# Altium schematic sheet DE-160724.SchDoc: Toroid soft start
size A3; Author: eldar6776@hotmail.com; DrawnBy: Eldar Dedic; Organization: JUBERA d.o.o.; Address1: Braće Mulić 81; Address2: 71000 Sarajevo; Address3: Federacija BiH; Address4: Bosna i Hercegovina; DocumentNumber: DE-100224; Revision: 278; SheetNumber: 1; SheetTotal: 2
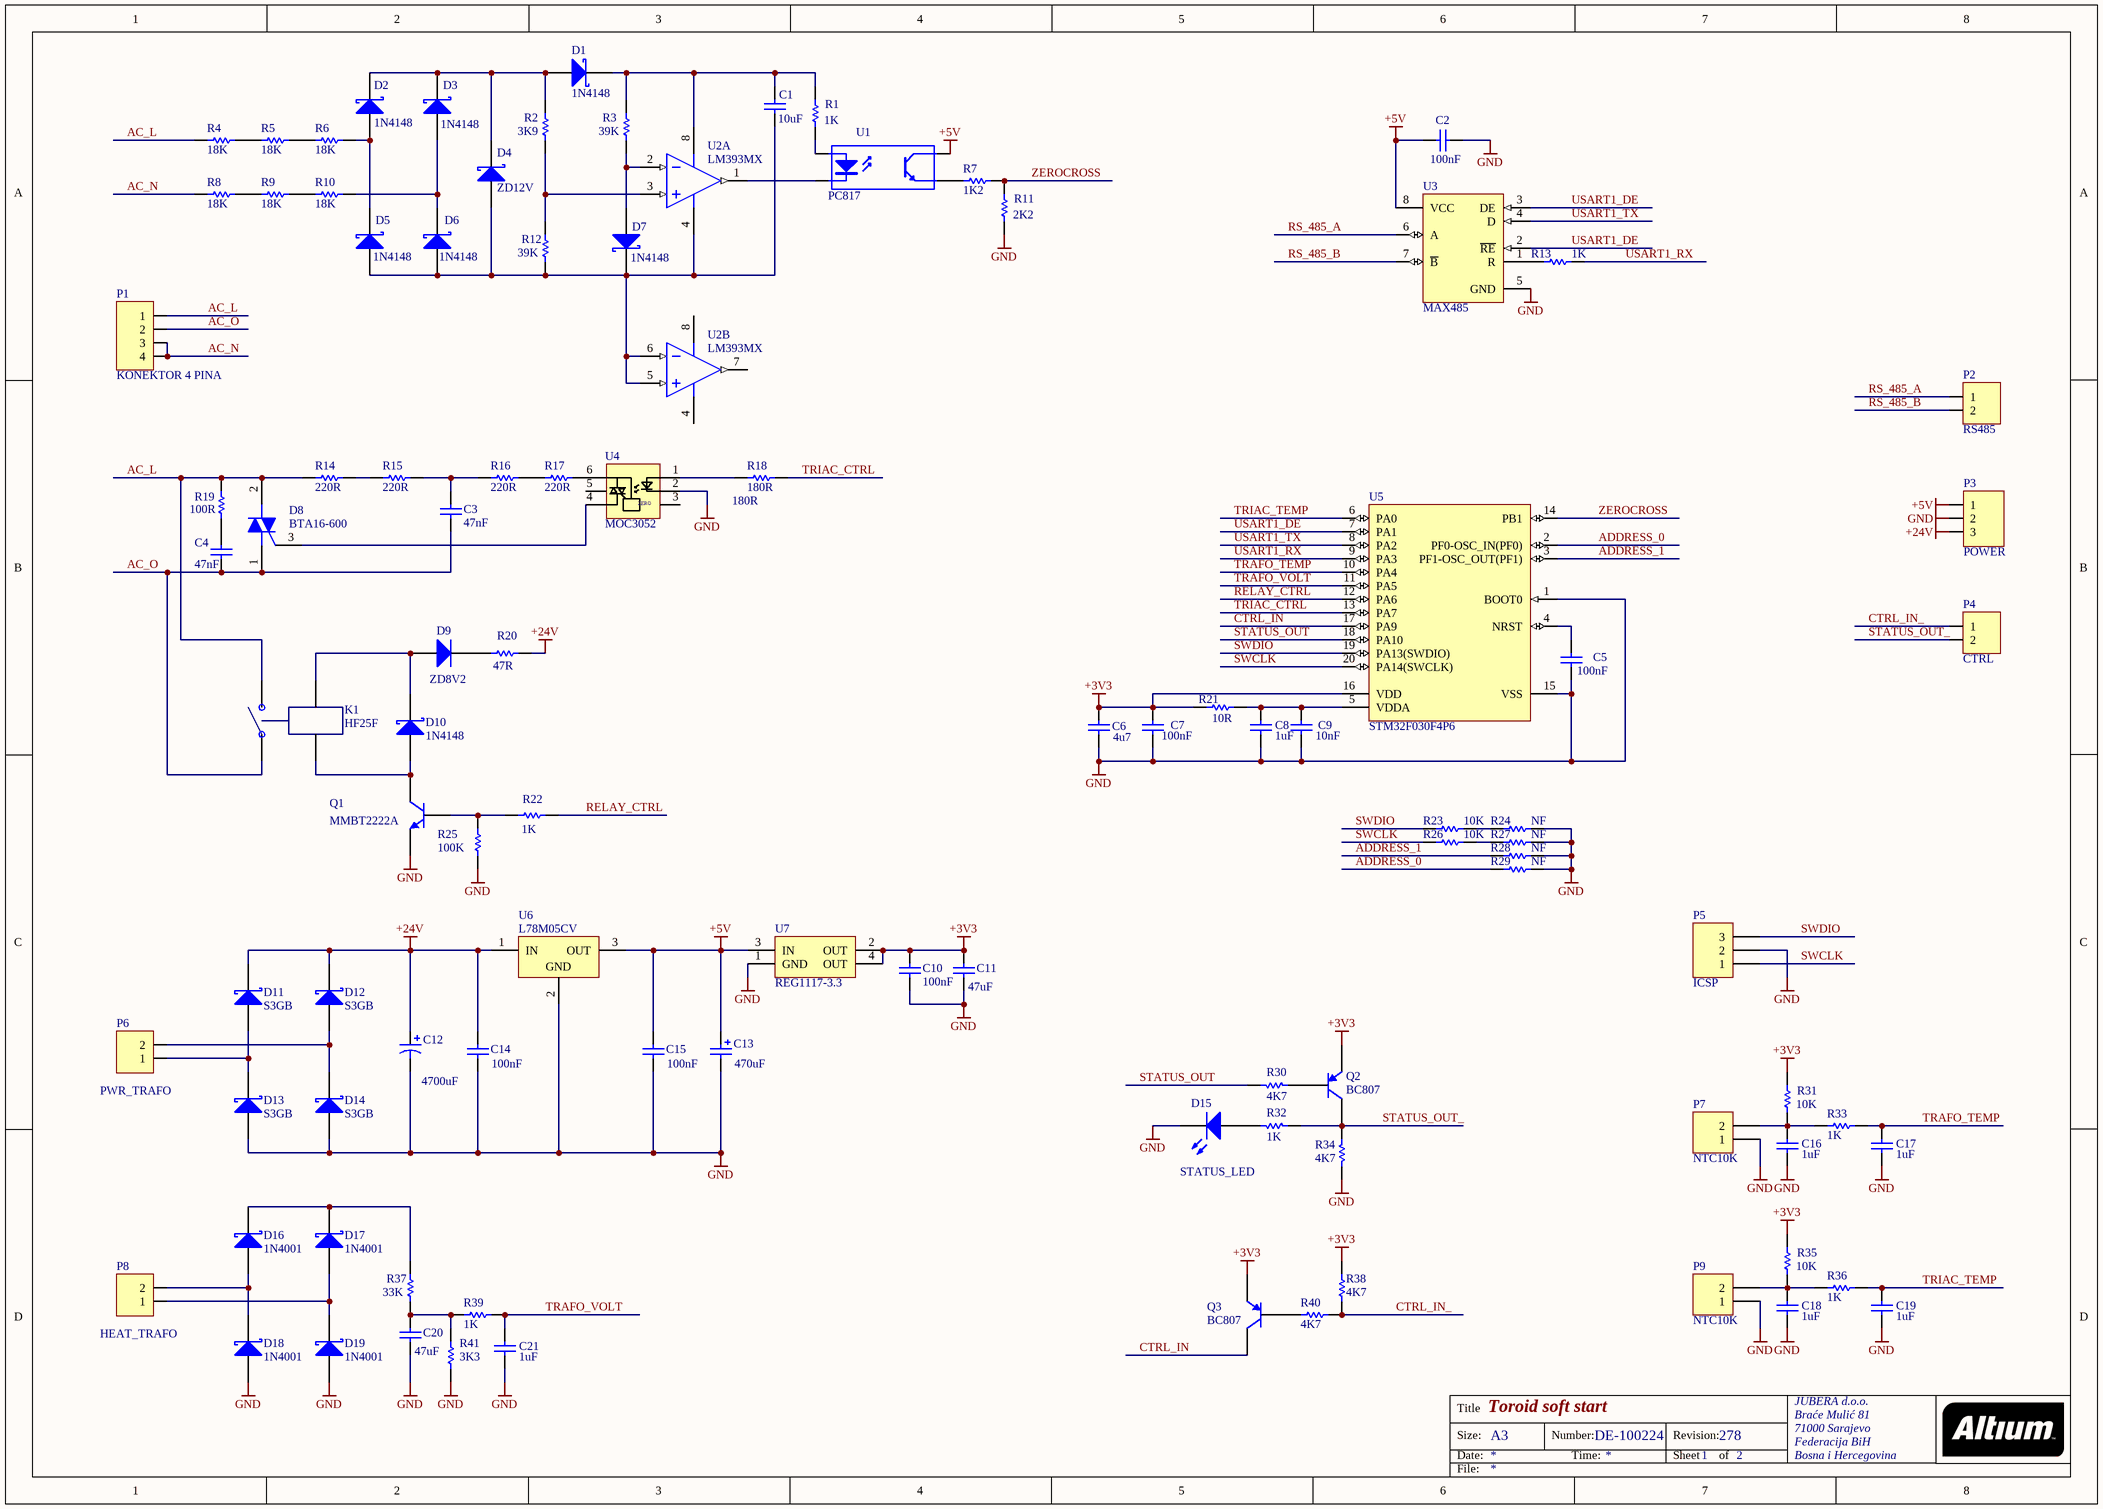
[diagram p0: DE-160724.SchDoc]

## Parts
C1  10uF  [0805]
C2  100nF  [0603]
C3  47nF  [X2 CAP]
C4  47nF  [X2 CAP]
C5  100nF  [0603]
C6  4u7  [0805]
C7  100nF  [0603]
C8  1uF  [0603]
C9  10nF  [0603]
C10  100nF  [0603]
C11  value 47uF  [1206]  (hidden comment: C1206)
C12  4700uF  [CAPPR5-13X25]
C13  470uF  [CAPPR5-10X16]
C14  100nF  [0603]
C15  100nF  [0603]
C16  1uF  [0603]
C17  1uF  [0603]
C18  1uF  [0603]
C19  1uF  [0603]
C20  value 47uF  [1206]  (hidden comment: C1206)
C21  1uF  [0603]
D1  1N4148  [SOD323]
D2  1N4148  [SOD323]
D3  1N4148  [SOD323]
D4  ZD12V  [SMB]
D5  1N4148  [SOD323]
D6  1N4148  [SOD323]
D7  1N4148  [SOD323]
D8  BTA16-600  [ONSC-TO-220-3-221A-07]
D9  ZD8V2  [DO-41]
D10  1N4148  [SOD323]
D11  S3GB  [SMB]
D12  S3GB  [SMB]
D13  S3GB  [SMB]
D14  S3GB  [SMB]
D15  STATUS_LED  [1.6X0.8X0.8]
D16  1N4001  [SMB]
D17  1N4001  [SMB]
D18  1N4001  [SMB]
D19  1N4001  [SMB]
K1  HF25F  [HF25F]
P1  KONEKTOR 4 PINA  [KONEKTOR 4 PINA]
P2  RS485  [TERMINAL BLOK 2]
P3  POWER  [TERMINAL BLOK 3]
P4  CTRL  [TERMINAL BLOK 2]
P5  ICSP  [HDR1X3]
P6  PWR_TRAFO  [KONEKTOR 2 PINA]
P7  NTC10K  [HDR1X2]
P8  HEAT_TRAFO  [KONEKTOR 2 PINA]
P9  NTC10K  [HDR1X2]
Q1  MMBT2222A  [SOT23_N]
Q2  BC807  [SOT23_N]
Q3  BC807  [SOT23_N]
R1  1K  [ERA-0603]
R2  3K9  [ERA-0603]
R3  39K  [ERA-0603]
R4  18K  [ERA-0805]
R5  18K  [ERA-0805]
R6  18K  [ERA-0805]
R7  1K2  [ERA-0603]
R8  18K  [ERA-0805]
R9  18K  [ERA-0805]
R10  18K  [ERA-0805]
R11  2K2  [ERA-0603]
R12  39K  [ERA-0603]
R13  1K  [ERA-0603]
R14  220R  [ERA-0805]
R15  220R  [ERA-0805]
R16  220R  [ERA-0805]
R17  220R  [ERA-0805]
R18  180R  [ERA-0603]
R19  100R  [1W100R]
R20  47R  [AXIAL-0.3]
R21  10R  [ERA-0603]
R22  1K  [ERA-0603]
R23  10K  [ERA-0603]
R24  NF  [ERA-0603]
R25  100K  [ERA-0603]
R26  10K  [ERA-0603]
R27  NF  [ERA-0603]
R28  NF  [ERA-0603]
R29  NF  [ERA-0603]
R30  4K7  [ERA-0603]
R31  10K  [ERA-0603]
R32  1K  [ERA-0603]
R33  1K  [ERA-0603]
R34  4K7  [ERA-0603]
R35  10K  [ERA-0603]
R36  1K  [ERA-0603]
R37  33K  [ERA-0603]
R38  4K7  [ERA-0603]
R39  1K  [ERA-0603]
R40  4K7  [ERA-0603]
R41  3K3  [ERA-0603]
U1  PC817  [DIP-4]
U2  LM393MX  [M08A_N]  (parts A,B of 2)
U3  MAX485  [D008_L]
U4  MOC3052  [DIP6]
U5  STM32F030F4P6  [STM-TSSOP20_N]
U6  L78M05CV  [TO220]
U7  REG1117-3.3  [ZZ311]

## Nets
+3V3: C6.1 C7.1 C10.2 C11.2 Q2.2(E) Q3.2(E) R21.2 R31.2 R35.2 R38.1 U5.16(VDD) U7.2(OUT) U7.4(OUT)
+5V: C2.1 C13.1 C15.2 P3.1 U1.4(C) U3.8(VCC) U6.3(OUT) U7.3(IN)
+24V: C12.1 C14.2 D11.2(K) D12.2(K) P3.3 R20.2 U6.1(IN)
GND: C2.2 C5.2 C6.2 C7.2 C8.2 C9.2 C10.1 C11.1 C12.2 C13.2 C14.1 C15.1 C16.2 C17.2 C18.2 C19.2 C20.1 C21.2 D13.1(A) D14.1(A) D15.2(K) D18.1(A) D19.1(A) P3.2 P5.2 P7.1 P9.1 Q1.2(E) R11.1 R24.1 R25.1 R27.1 R28.1 R29.1 R34.2 R41.1 U3.5(GND) U4.2 U5.1(BOOT0) U5.15(VSS) U6.2(GND) U7.1(GND)
AC_L: D8.2(MT2) K1.4 P1.1 R4.1 R14.1 R19.2
AC_N: P1.3 P1.4 R8.1
AC_O: C3.1 C4.1 D8.1(MT1) K1.3 P1.2
ADDRESS_0: R29.2 U5.2(PF0-OSC_IN(PF0))
ADDRESS_1: R28.2 U5.3(PF1-OSC_OUT(PF1))
CTRL_IN: Q3.3(C) U5.17(PA9)
CTRL_IN_: P4.1 R38.2 R40.2
RELAY_CTRL: R22.1 U5.12(PA6)
RS_485_A: P2.1 U3.6(A)
RS_485_B: P2.2 U3.7(~{B})
STATUS_OUT: R30.2 U5.18(PA10)
STATUS_OUT_: P4.2 Q2.3(C) R32.1 R34.1
SWCLK: P5.1 R26.2 U5.20(PA14(SWCLK))
SWDIO: P5.3 R23.2 U5.19(PA13(SWDIO))
TRAFO_TEMP: C17.1 R33.1 U5.10(PA4)
TRAFO_VOLT: C21.1 R39.1 U5.11(PA5)
TRIAC_CTRL: R18.1 U5.13(PA7)
TRIAC_TEMP: C19.1 R36.1 U5.6(PA0)
USART1_DE: U3.2(~{RE}) U3.3(DE) U5.7(PA1)
USART1_RX: R13.1 U5.9(PA3)
USART1_TX: U3.4(D) U5.8(PA2)
ZEROCROSS: R7.1 R11.2 U5.14(PB1)
NetC1_1: C1.1 D4.1(A) D5.2(A) D6.2(A) D7.1(K) R12.1 U2.4(GND) U2.5(INB+) U2.6(INB-)
NetC1_2: C1.2 D1.1(K) R1.2 R3.2 U2.8(V+)
NetC3_2: C3.2 R15.2 R16.1
NetC4_2: C4.2 R19.1
NetC5_1: C5.1 U5.4(NRST)
NetC8_1: C8.1 C9.1 R21.1 U5.5(VDDA)
NetC16_1: C16.1 P7.2 R31.1 R33.2
NetC18_1: C18.1 P9.2 R35.1 R36.2
NetC20_2: C20.2 R37.1 R39.2 R41.2
NetD1_2: D1.2(A) D2.1(K) D3.1(K) D4.2(K) R2.2
NetD2_2: D2.2(A) D5.1(K) R6.2
NetD3_2: D3.2(A) D6.1(K) R10.2
NetD7_2: D7.2(A) R3.1 U2.2(INA-)
NetD8_3: D8.3(G) U4.4
NetD9_1: D9.1(A) D10.1(K) K1.2
NetD9_2: D9.2(K) R20.1
NetD10_2: D10.2(A) K1.1 Q1.3(C)
NetD11_1: D11.1(A) D13.2(K) P6.1
NetD12_1: D12.1(A) D14.2(K) P6.2
NetD15_1: D15.1(A) R32.2
NetD16_1: D16.1(A) D18.2(K) P8.2
NetD16_2: D16.2(K) D17.2(K) R37.2
NetD17_1: D17.1(A) D19.2(K) P8.1
NetQ1_1: Q1.1(B) R22.2 R25.2
NetQ2_1: Q2.1(B) R30.1
NetQ3_1: Q3.1(B) R40.1
NetR1_1: R1.1 U1.1(A)
NetR2_1: R2.1 R12.2 U2.3(INA+)
NetR4_2: R4.2 R5.1
NetR5_2: R5.2 R6.1
NetR7_2: R7.2 U1.3(E)
NetR8_2: R8.2 R9.1
NetR9_2: R9.2 R10.1
NetR13_2: R13.2 U3.1(R)
NetR14_2: R14.2 R15.1
NetR16_2: R16.2 R17.1
NetR17_2: R17.2 U4.6
NetR18_2: R18.2 U4.1
NetR23_1: R23.1 R24.2
NetR26_1: R26.1 R27.2
NetU1_2: U1.2(K) U2.1(OUTA)

Not connected (* = marked no-connect by the designer): U2 7(OUTB); U4 3 5

## Notes on the sheet
- Title
- Size:
- Date:
- A3
- Number:
- Time:
- Revision:
- Sheet
- of
- File:
- (in symbol MOC3081) ZERO

## Library data of the parts
C1 C6 = C0805: Ceramic Chip Capacitor - Standard; Note: Footprint corresponds to dimensions for bulk cassette packaging. This case size has tightened tolerances.; Published: 17-Jul-2002; LatestRevisionDate: 19-Mar-2004; LatestRevisionNote: Silkscreen size reduced.; DatasheetDocument: Mar-2001; PackageDocument: Mar-2001; PackageReference: 0805; Publisher: Altium Limited; Code_JEITA: 0805; Code_IPC: 2012[0805]; ComponentLink1Description: Manufacturer Link; ComponentLink1URL: http://www.kemet.com/; ComponentLink2Description: Datasheet; ComponentLink2URL: http://www.kemet.com/kemet/web/homepage/kechome.nsf/vapubfilesname/F3102TA.pdf/$file/F3102TA.pdf
  C1: Value: 10uF
  C6: Value: 4u7
C2 C5 C7-C10 C14-C19 C21 = C0603: Ceramic Chip Capacitor - Standard; Note: Footprint corresponds to dimensions for bulk cassette packaging. This case size has tightened tolerances.; Published: 17-Jul-2002; LatestRevisionDate: 19-Mar-2004; LatestRevisionNote: Silkscreen size reduced.; DatasheetDocument: Mar-2001; PackageDocument: Mar-2001; PackageReference: 0603; Publisher: Altium Limited; Code_JEITA: 0603; Code_IPC: 1608 [0603]; ComponentLink1Description: Manufacturer Link; ComponentLink1URL: http://www.kemet.com/; ComponentLink2Description: Datasheet; ComponentLink2URL: http://www.kemet.com/kemet/web/homepage/kechome.nsf/vapubfilesname/F3102TA.pdf/$file/F3102TA.pdf
  C2 C5 C7 C14 C15: Value: 100nF
  C8 C16-C19 C21: Value: 1uF
  C9: Value: 10nF
C3 C4 = CAP X2: X2 275VAC capaitor
C11 C20 = C1206: Ceramic Chip Capacitor - Standard; Published: 17-Jul-2002; LatestRevisionDate: 19-Mar-2004; LatestRevisionNote: Silkscreen size reduced.; DatasheetDocument: Mar-2001; PackageDocument: Mar-2001; PackageReference: 1206; Publisher: Altium Limited; Code_JEITA: 1206; Code_IPC: 3216 [1206]; ComponentLink1Description: Manufacturer Link; ComponentLink1URL: http://www.kemet.com/; ComponentLink2Description: Datasheet; ComponentLink2URL: http://www.kemet.com/kemet/web/homepage/kechome.nsf/vapubfilesname/F3102TA.pdf/$file/F3102TA.pdf
C12 = EKA00GG447C00: Aluminum Electrolytic Capacitor, Radial Style with Long Leads: 4700uF, 10V; Note: Refer to Manufacturer's Data Sheets for other lead formations; DrillSize: Nominal, Rounded To The Nearest 0.1mm; Published: 19-Mar-2004; DatasheetDocument: 20-Feb-2001; PackageReference: CAPPR5-13X25; Publisher: Altium Limited; ComponentLink1Description: Manufacturer Link; ComponentLink1URL: http://www.vishay.com/; ComponentLink2Description: Datasheet; ComponentLink2URL: http://www.vishay.com/docs/25014/eka.pdf; Value: 4700uF
C13 = EKA00DD347F00: Aluminum Electrolytic Capacitor, Radial Style with Long Leads: 470uF, 35V; Note: Refer to Manufacturer's Data Sheets for other lead formations; DrillSize: Nominal, Rounded To The Nearest 0.1mm; Published: 19-Mar-2004; DatasheetDocument: 20-Feb-2001; PackageReference: CAPPR5-10X16; Publisher: Altium Limited; ComponentLink1Description: Manufacturer Link; ComponentLink1URL: http://www.vishay.com/; ComponentLink2Description: Datasheet; ComponentLink2URL: http://www.vishay.com/docs/25014/eka.pdf; Value: 470uF
D1-D3 D5-D7 D10 = 1PS76SB10: Schottky Barrier Diode; Published: 17-Sep-2003; LatestRevisionDate: 19-Mar-2004; LatestRevisionNote: Silkscreen size reduced.; DatasheetVersion: 14-Oct-1996; PackageVersion: May-1999; PackageReference: SOD323; Publisher: Altium Limited; PackageDescription: SOD-323/SC-76; 2 Leads; Body 1.7 x 1.3 mm, (LxW); ComponentLink1Description: Manufacturer Link; ComponentLink1URL: http://www.semiconductors.philips.com/; ComponentLink2Description: Datasheet; ComponentLink2URL: http://www.semiconductors.philips.com/acrobat/datasheets/1PS76SB10_2.pdf
D4 = 10BQ100: Schottky Rectifier; Published: 8-Jun-2000; LatestRevisionDate: 17-Jul-2002; LatestRevisionNote: Re-released for DXP Platform.; DatasheetVersion: PD-2.437A; PackageReference: SMB; Publisher: Altium Limited; PackageDescription: DO-214-AA/SMB; 2 C-Bend Leads; Body 5.3 x 3.6 mm, inc. leads (LxW); ComponentLink1Description: Manufacturer Link; ComponentLink1URL: http://www.irf.com/; ComponentLink2Description: Datasheet; ComponentLink2URL: http://www.irf.com/product-info/datasheets/data/10bq100.pdf
D8 = BTA08-600BW3G: Triacs, Silicon Bidirectional Thyristor, 3-Pin TO-220, Pb-Free, Tube; Manufacturer: On Semiconductor; IGT Max (mA): 50; IT(RMS) Max (A): 8; ITSM Max (A): 90; DatasheetVersion: Rev. 1; PackageVersion: Rev. O, 07/2008; PackageReference: TO-220-3-221A-07; PackageDescription: 3-Pin Flange Mount, Vertical Straight Lead, Body 9.97 x 4.445 mm, Pitch 2.54 mm; Supplier 1: Digi-Key; Supplier Part Number 1: BTA08-600BW3G-ND; Supplier 2: Newark; Supplier Part Number 2: 13P2072; Supplier 3: Mouser; Supplier Part Number 3: 863-BTA08-600BW3G; Packing: Tube; RoHS: Pb-Free; Mounting Technology: Through Hole; PartNumber: BTA08-600BW3G; ComponentLink1Description: Manufacturer URL; ComponentLink1URL: http://www.onsemi.com/; ComponentLink2Description: Datasheet; ComponentLink2URL: http://www.onsemi.com/pub_link/Collateral/BTA08-600BW3-D.PDF; ComponentLink3Description: Package Specification; ComponentLink3URL: http://www.onsemi.com/pub_link/Collateral/221A-07.PDF
D9 = 1N4003: 1.0 Ampere General Purpose Rectifier; Published: 8-Jun-2000; LatestRevisionDate: 17-Jul-2002; LatestRevisionNote: Re-released for DXP Platform.; DatasheetDocument: 1998; PackageDocument: Aug-1999; PackageReference: DO-41; Publisher: Altium Limited; Code_JEDEC: DO-204-AL; ComponentLink1Description: Manufacturer Link; ComponentLink1URL: http://www.fairchildsemi.com/; ComponentLink2Description: Pinout Specification; ComponentLink2URL: http://www.fairchildsemi.com/ds/1N%2F1N4001.pdf
D11-D14 D16-D19 = D Schottky: Schottky Diode; Published: 8-Jun-2000; LatestRevisionDate: 17-Jul-2002; LatestRevisionNote: Re-released for DXP Platform.; PackageReference: SMB; Publisher: Altium Limited; PackageDescription: DO-214-AA/SMB; 2 C-Bend Leads; Body 5.3 x 3.6 mm, inc. leads (LxW); Code_JEDEC: DO-214-AA
D15 = HSMB-C190: Blue Surface Mount Chip LED, Blue; LuminousIntensity: 1.6mcd (Minimum).; PCB_Layout: Complies with manufacturer's recommendation.; Published: 11-Dec-2002; DatasheetVersion: 26-Feb-2002; PackageVersion: Mar-2002; PackageReference: 1.6X0.8X0.8; Publisher: Altium Limited; PackageDescription: SM LED; 2 Flat Leads; LED_Colour: Blue; ComponentLink1Description: Manufacturer Link; ComponentLink1URL: http://www.avagotech.com/; ComponentLink2Description: Datasheet; ComponentLink2URL: http://cp.literature.agilent.com/litweb/pdf/5988-5211EN.pdf
K1 = HF25F: PCB relay 250VAC/20A 30VDC/16A
P1 = KONEKTOR 4 PINA: Razdvojivi konektor 4 pina
P2 P4 = TERMINAL BLOK 2: Terminal blok konektor 3,5 mm
P3 = TERMINAL BLOK 3: 3 pinski terminal blok konektor
P5 = Header 3: Header, 3-Pin; LatestRevisionDate: 17-Jul-2002; LatestRevisionNote: Re-released for DXP Platform.; Publisher: Altium Limited
P6 P8 = KONEKTOR 2 PINA: Razdvojivi konetor 2 pina
P7 P9 = Header 2: Header, 2-Pin; LatestRevisionDate: 17-Jul-2002; LatestRevisionNote: Re-released for DXP Platform.; Publisher: Altium Limited
Q1 = BC817: NPN General-purpose Transistor; Published: 17-Sep-2003; LatestRevisionDate: 12-Dec-2006; LatestRevisionNote: IPC-7351 Footprint Added.; DatasheetVersion: Jun-1999; PackageVersion: May-1999; PackageReference: SOT23; Publisher: Altium Limited; PackageDescription: 3-Pin SOT-23 Package 0.95 mm Pitch, 2.3 mm Lead Span; ComponentLink1Description: Manufacturer Link; ComponentLink1URL: http://www.semiconductors.philips.com/; ComponentLink2Description: Datasheet; ComponentLink2URL: http://www.semiconductors.philips.com/acrobat/datasheets/BC817_BC817W_BC337_5.pdf
Q2 Q3 = BC807: PNP General-purpose Transistor; Published: 17-Sep-2003; LatestRevisionDate: 12-Dec-2006; LatestRevisionNote: IPC-7351 Footprint Added.; DatasheetVersion: 8-Apr-1999; PackageVersion: May-1999; PackageReference: SOT23; Publisher: Altium Limited; PackageDescription: 3-Pin SOT-23 Package 0.95 mm Pitch, 2.3 mm Lead Span; ComponentLink1Description: Manufacturer Link; ComponentLink1URL: http://www.semiconductors.philips.com/; ComponentLink2Description: Datasheet; ComponentLink2URL: http://www.semiconductors.philips.com/acrobat/datasheets/BC807_BC807W_BC327_5.pdf
R1-R3 R7 R11 R12 R18 R22 R25 R31 R33 R35-R37 R39 R41 = ERAV: Metal Film Thermosensitive Chip Resistor, 0.56 Ohm to 10k Ohm Range, 5% Tolerance, 0603 Size, 0.063 W; Note: If flow soldering, adjust pad width of PCB Footprint to 0.7 - 0.8 times the width of the resistor.; Published: 17-Dec-2003; LatestRevisionDate: 19-Mar-2004; LatestRevisionNote: Silkscreen size reduced.; PackageDocument: Mar-2003; PackageReference: ERA-0603; Publisher: Altium Limited; Code_IPC: 1608 [0603]; ComponentLink1Description: Manufacturer Link; ComponentLink1URL: http://www.panasonic.com/industrial/components/resistive_products.htm; ComponentLink2Description: Datasheet; ComponentLink2URL: http://www.panasonic.com/industrial/components/pdf/AOF0000CE1.pdf
  R18: Value: 180R
R4-R6 R8-R10 R14-R17 = ERAS: Metal Film Thermosensitive Chip Resistor, 0.56 Ohm to 10k Ohm Range, 5% Tolerance, 0805 Size, 0.1 W; Note: If flow soldering, adjust pad width of PCB Footprint to 0.7 - 0.8 times the width of the resistor.; Published: 17-Dec-2003; LatestRevisionDate: 19-Mar-2004; LatestRevisionNote: Silkscreen size reduced.; PackageDocument: Mar-2003; PackageReference: ERA-0805; Publisher: Altium Limited; Code_IPC: 2012 [0805]; ComponentLink1Description: Manufacturer Link; ComponentLink1URL: http://www.panasonic.com/industrial/components/resistive_products.htm; ComponentLink2Description: Datasheet; ComponentLink2URL: http://www.panasonic.com/industrial/components/pdf/AOF0000CE1.pdf
R13 R21 R23 R24 R26-R30 R32 R34 R38 R40 = ERA6Y: Rectangular Thick Film Chip Resistor, 10 Ohm to 1M Ohm Range, 0.1% and 0.5% Tolerance, 0805 Size, 0.1 W; Note: If flow soldering, adjust pad width of PCB Footprint to 0.7 - 0.8 times the width of the resistor.; Published: 17-Dec-2003; LatestRevisionDate: 19-Mar-2004; LatestRevisionNote: Silkscreen size reduced.; PackageDocument: Mar-2003; PackageReference: ERA-0805; Publisher: Altium Limited; Code_IPC: 2012 [0805]; ComponentLink1Description: Manufacturer Link; ComponentLink1URL: http://www.panasonic.com/industrial/components/resistive_products.htm; ComponentLink2Description: Datasheet; ComponentLink2URL: http://www.panasonic.com/industrial/components/pdf/AOA0000CE8.pdf
R19 = 1W100R: Carbon F 1W resistor; Published: 17-Dec-2003; PackageReference: RD6.35x2.3; Publisher: Altium Limited; ComponentLink1Description: Manufacturer Link; ComponentLink1URL: http://www.panasonic.com/industrial/components/resistive_products.htm; ComponentLink2Description: Datasheet; ComponentLink2URL: http://www.panasonic.com/industrial/components/pdf/AOA0000CE12.pdf
R20 = Res1: Resistor; Published: 8-Jun-2000; LatestRevisionDate: 17-Jul-2002; LatestRevisionNote: Re-released for DXP Platform.; PackageReference: AXIAL-0.3; Publisher: Altium Limited; PackageDescription: Axial Device, Thru-Hole; 2 Leads; 0.3 in Pin Spacing; Value: 47R
U1 = PC817: 4-Pin Phototransistor Optocoupler; Published: 24-Mar-1999; LatestRevisionDate: 04-Mar-2005; LatestRevisionNote: Sch pins 3 & 4 Swapped.; DatasheetVersion: Nov-2003; PackageReference: DIP-4; Publisher: Altium Limited
U2 = LM393MX: Low Power Low Offset Voltage Dual Comparator, 8-pin Narrow SOIC; Manufacturer: National Semiconductor; PackageTopMarking: NSZXTT*LM*393M; PowerWise: N; High-Reliability: Y; DatasheetVersion: Aug-2002; PackageVersion: revM, May-2009; PackageReference: M08A; PackageDescription: SOIC Narrow, 4.9 x 3.9 x 1.45mm, 8 Lead, 1.27mm Pitch; PartNumber: LM393MX; RoHS: N; PinCount: 8; CompType: Comparator; Code_JEDEC: MS-012-AA; Code_IPC: SOIC127P600-8; ComponentLink1Description: Manufacturer URL; ComponentLink1URL: http://www.national.com/; ComponentLink2Description: LM393 Datasheet; ComponentLink2URL: http://www.national.com/ds/LM/LM393.pdf; ComponentLink3Description: LM393 Web Page; ComponentLink3URL: http://www.national.com/pf/LM/LM393.html; ComponentLink4Description: M08A Package Page; ComponentLink4URL: http://www.national.com/packaging/folders/m08a.html
U3 = SN75176BD: Differential Bus Transceiver; Note: Receiver Hysteresis of 50mV Typical; Published: 15-May-2002; LatestRevisionDate: 13-Apr-2006; LatestRevisionNote: IPC-7351 Footprint Added.; DatasheetVersion: Sep-1989; PackageVersion: Jan-1998; PackageReference: D008; Publisher: Altium Limited; PackageDescription: 8-Pin Small Outline Integrated Circuit 1.27 mm Pitch; Code_IPC: SOIC127P600-8; ComponentLink1Description: Manufacturer Link; ComponentLink1URL: http://www.ti.com/; ComponentLink2Description: Datasheet; ComponentLink2URL: http://www-s.ti.com/sc/ds/sn75176b.pdf
U4 = MOC3081: Zero-Cross Optoisolator Triac Driver
U5 = STM32F030F4P6: ARM Cortex-M0 32-bit MCU, 16 KB Flash, 4 KB Internal RAM, 15 I/Os, 20-pin TSSOP, -40 to 85 degC, Tube; FLASH Size (Prog) (kB): 16; I/Os (High Current): 15; Internal RAM Size (kB): 4; Operating Frequency(F) (Processor speed) (MHz): 48; Supply Voltage(Vcc) min (V): 2.4; DatasheetVersion: Rev. 1; PackageVersion: Rev. 1, 11/2012; PackageReference: TSSOP20; PackageDescription: 20-Pin Thin Shrink Small Outline Package, 6.5 x 4.4 mm Body, 0.65 mm Pitch; Supplier 1: Digi-Key; Supplier Part Number 1: 497-14044-5-ND; Supplier 2: Newark; Supplier Part Number 2: 06X3648; Supplier 3: Mouser; Supplier Part Number 3: 511-STM32F030F4P6; Core: ARM Cortex-M0; Packing: Tube; Mounting Technology: Surface Mount; PartNumber: STM32F030F4P6; ComponentLink1Description: Manufacturer URL; ComponentLink1URL: http://www.st.com/web/en/home.html; ComponentLink2Description: Datasheet; ComponentLink2URL: http://www.st.com/st-web-ui/static/active/en/resource/technical/document/datasheet/DM00088500.pdf; ComponentLink3Description: Package Specification; ComponentLink3URL: http://www.st.com/st-web-ui/static/active/en/resource/technical/document/datasheet/DM00065136.pdf
U6 = L78M05CV: Positive Voltage Regulator, 5V, 3-Pin TO-220; DatasheetVersion: Nov-2010; PackageVersion: ver3.0; PackageReference: TO220; PackageDescription: TO, Thru-Hole, Vertical, Heatsink Mounted; 3 In-Line Leads; Pitch 2.54 mm; PartNumber: L78M05CV; ComponentLink1Description: Manufacturer URL; ComponentLink1URL: http://www.st.com; ComponentLink2Description: Datasheet; ComponentLink2URL: http://www.st.com/internet/com/TECHNICAL_RESOURCES/TECHNICAL_LITERATURE/DATASHEET/CD00000447.pdf; ComponentLink3Description: Package Specification; ComponentLink3URL: http://www.st.com/internet/com/TECHNICAL_RESOURCES/TECHNICAL_LITERATURE/PACKAGE_INFORMATION/CD00004649.pdf
U7 = REG1117-3.3: 800mA and 1A Low Dropout Positive Regulator 2.85V, 3.3V, 5V, and Adjustable; Published: 8-Jun-2000; LatestRevisionDate: 17-Jul-2002; LatestRevisionNote: Re-released for DXP Platform.; DatasheetVersion: Sep-1997; PackageVersion: revC; PackageReference: ZZ311; Publisher: Altium Limited; PackageDescription: SOT-223/SC-73; 4 Leads; Body 6.7 x 7.3 mm, inc. leads (LxW max); ComponentLink1Description: Manufacturer Link; ComponentLink1URL: http://www.ti.com/; ComponentLink2Description: Datasheet; ComponentLink2URL: http://www-s.ti.com/sc/ds/REG1117.pdf